# EAGLE design XMICRO-BREAKOUT-CARD (EAGLE 6.3)
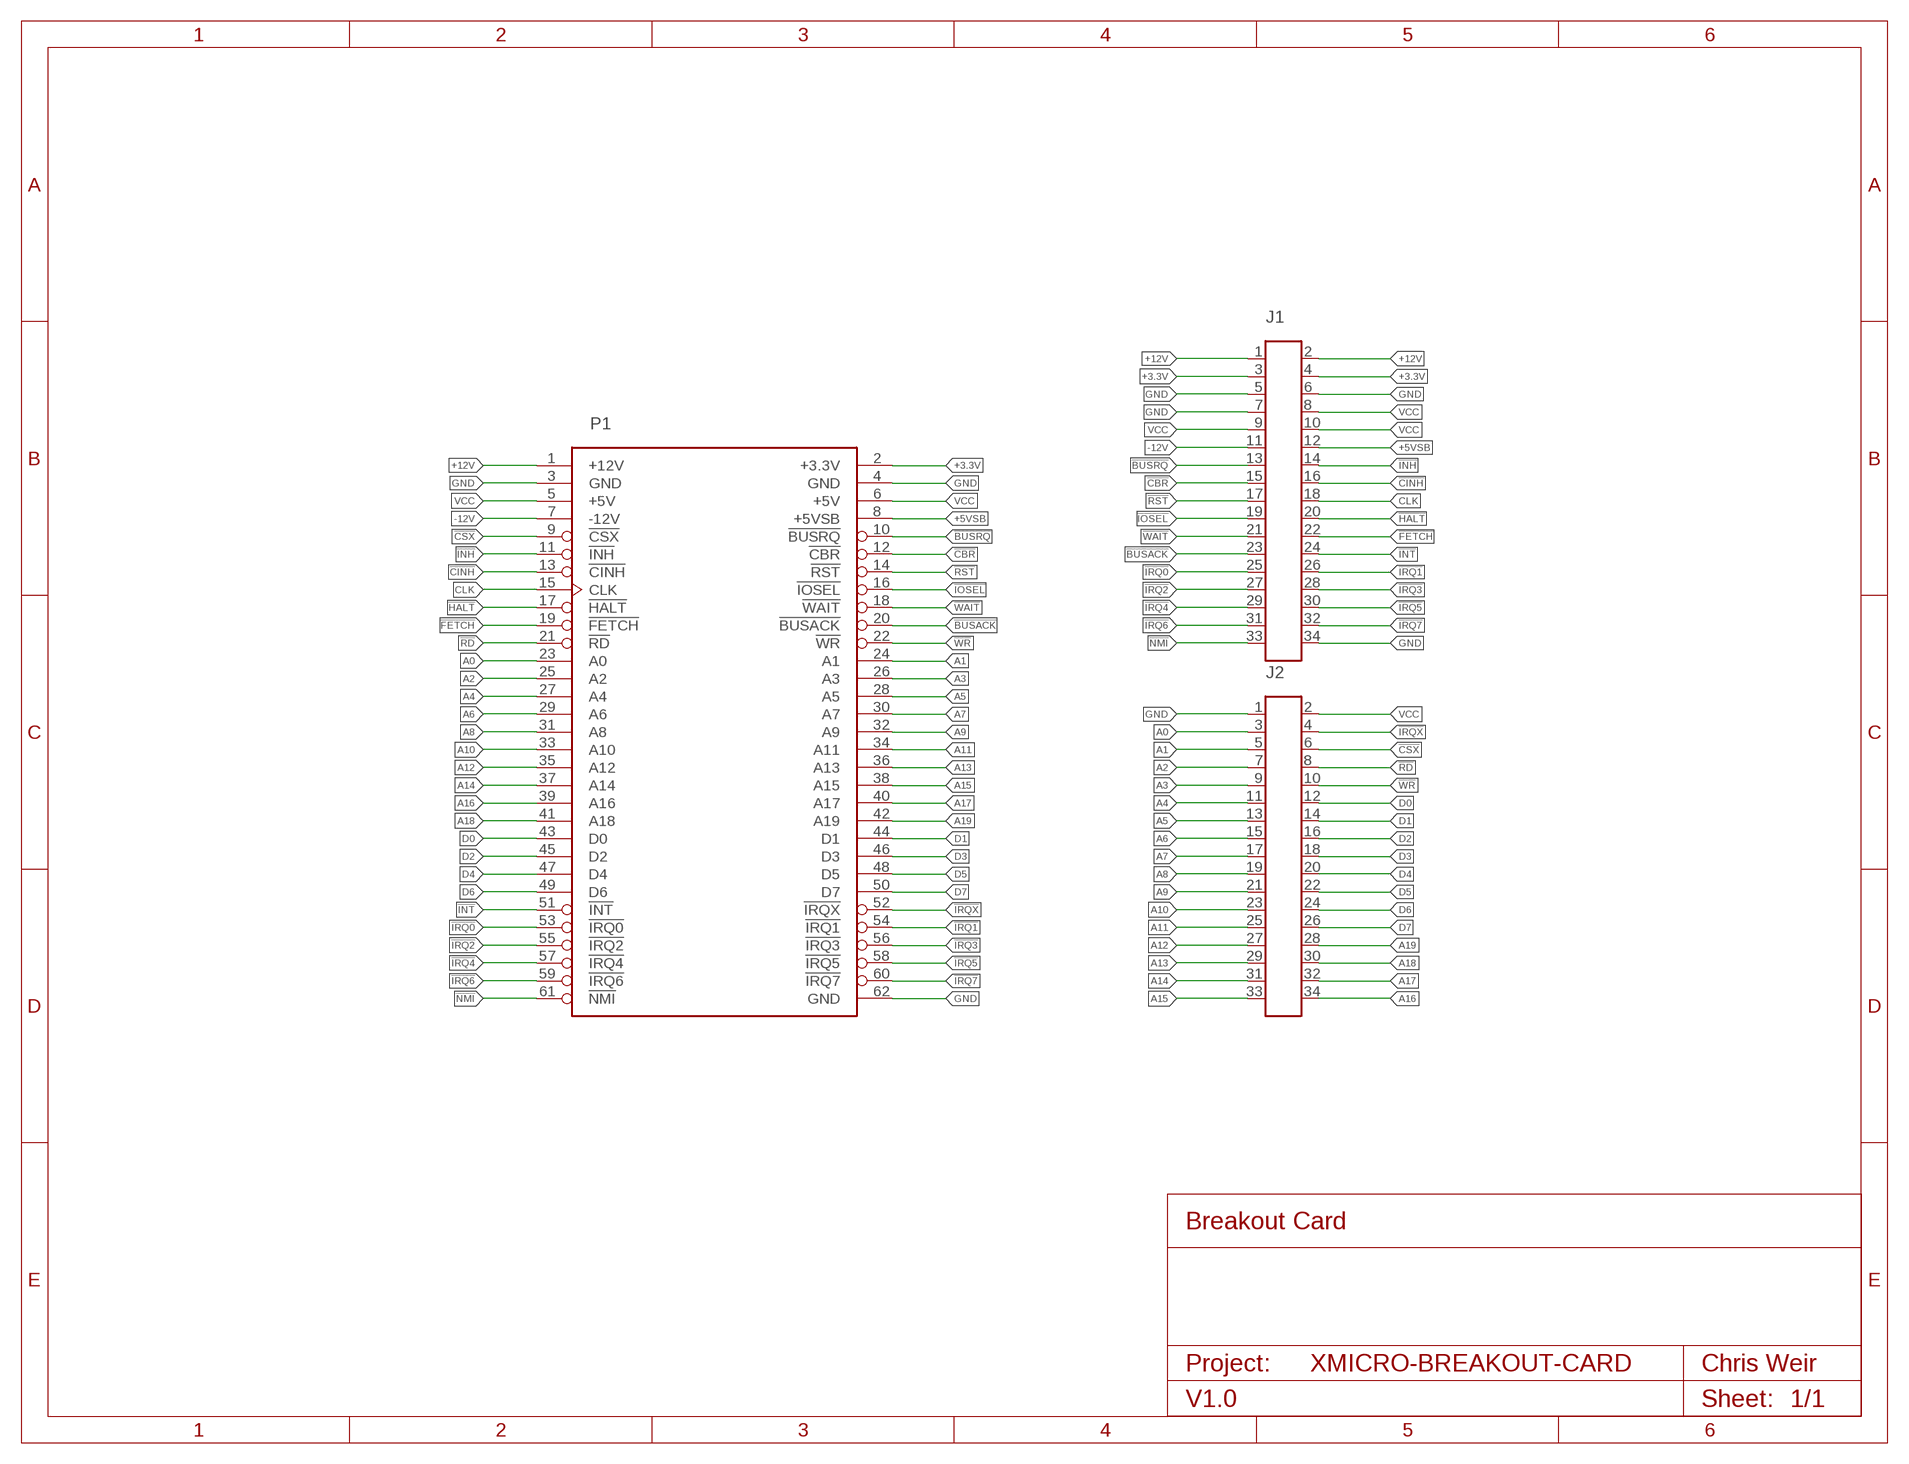
[diagram p0: schematic, sheet 1]

## Parts
J1  HDR-17X2  [HDR-17X2S]
J2  HDR-17X2  [HDR-17X2S]
P1  XMICRO-BUS-PHYSICAL-EDGE62M  [EDGE62M]

## Nets
!BUSACK: J1.23 P1.20(!BUSACK)
!BUSRQ: J1.13 P1.10(!BUSRQ)
!CBR: J1.15 P1.12(!CBR)
!CINH: J1.16 P1.13(!CINH)
!CSX: J2.6 P1.9(!CSX)
!FETCH: J1.22 P1.19(!FETCH)
!HALT: J1.20 P1.17(!HALT)
!INH: J1.14 P1.11(!INH)
!INT: J1.24 P1.51(!INT)
!IOSEL: J1.19 P1.16(!IOSEL)
!IRQ0: J1.25 P1.53(!IRQ0)
!IRQ1: J1.26 P1.54(!IRQ1)
!IRQ2: J1.27 P1.55(!IRQ2)
!IRQ3: J1.28 P1.56(!IRQ3)
!IRQ4: J1.29 P1.57(!IRQ4)
!IRQ5: J1.30 P1.58(!IRQ5)
!IRQ6: J1.31 P1.59(!IRQ6)
!IRQ7: J1.32 P1.60(!IRQ7)
!IRQX: J2.4 P1.52(!IRQX)
!NMI: J1.33 P1.61(!NMI)
!RD: J2.8 P1.21(!RD)
!RST: J1.17 P1.14(!RST)
!WAIT: J1.21 P1.18(!WAIT)
!WR: J2.10 P1.22(!WR)
+3.3V: J1.3 J1.4 P1.2(+3.3V)
+5VSB: J1.12 P1.8(+5VSB)
+12V: J1.1 J1.2 P1.1(+12V)
-12V: J1.11 P1.7(-12V)
A0: J2.3 P1.23(A0)
A1: J2.5 P1.24(A1)
A2: J2.7 P1.25(A2)
A3: J2.9 P1.26(A3)
A4: J2.11 P1.27(A4)
A5: J2.13 P1.28(A5)
A6: J2.15 P1.29(A6)
A7: J2.17 P1.30(A7)
A8: J2.19 P1.31(A8)
A9: J2.21 P1.32(A9)
A10: J2.23 P1.33(A10)
A11: J2.25 P1.34(A11)
A12: J2.27 P1.35(A12)
A13: J2.29 P1.36(A13)
A14: J2.31 P1.37(A14)
A15: J2.33 P1.38(A15)
A16: J2.34 P1.39(A16)
A17: J2.32 P1.40(A17)
A18: J2.30 P1.41(A18)
A19: J2.28 P1.42(A19)
CLK: J1.18 P1.15(CLK)
D0: J2.12 P1.43(D0)
D1: J2.14 P1.44(D1)
D2: J2.16 P1.45(D2)
D3: J2.18 P1.46(D3)
D4: J2.20 P1.47(D4)
D5: J2.22 P1.48(D5)
D6: J2.24 P1.49(D6)
D7: J2.26 P1.50(D7)
GND: J1.5 J1.6 J1.7 J1.34 J2.1 P1.3(GND) P1.4(GND) P1.62(GND)
VCC: J1.8 J1.9 J1.10 J2.2 P1.5(+5V) P1.6(+5V)

## Notes on the sheet
- Breakout Card
- Project: | Chris Weir
- V1.0 | Sheet:

## Library data of the parts
J1 J2 = Custom:HDR-17X2
P1 = Custom:XMICRO-BUS-PHYSICAL

## Net classes
1 GND: width 0.254 mm, clearance 0.381 mm

## Board
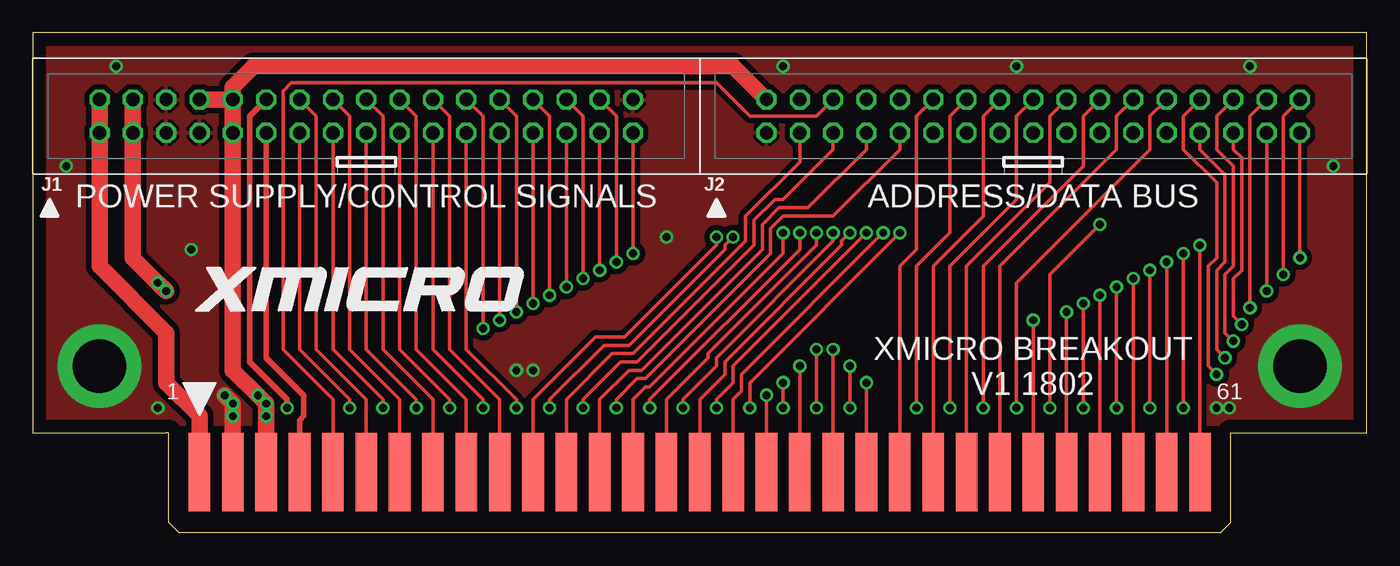
[diagram p1: board, top side]
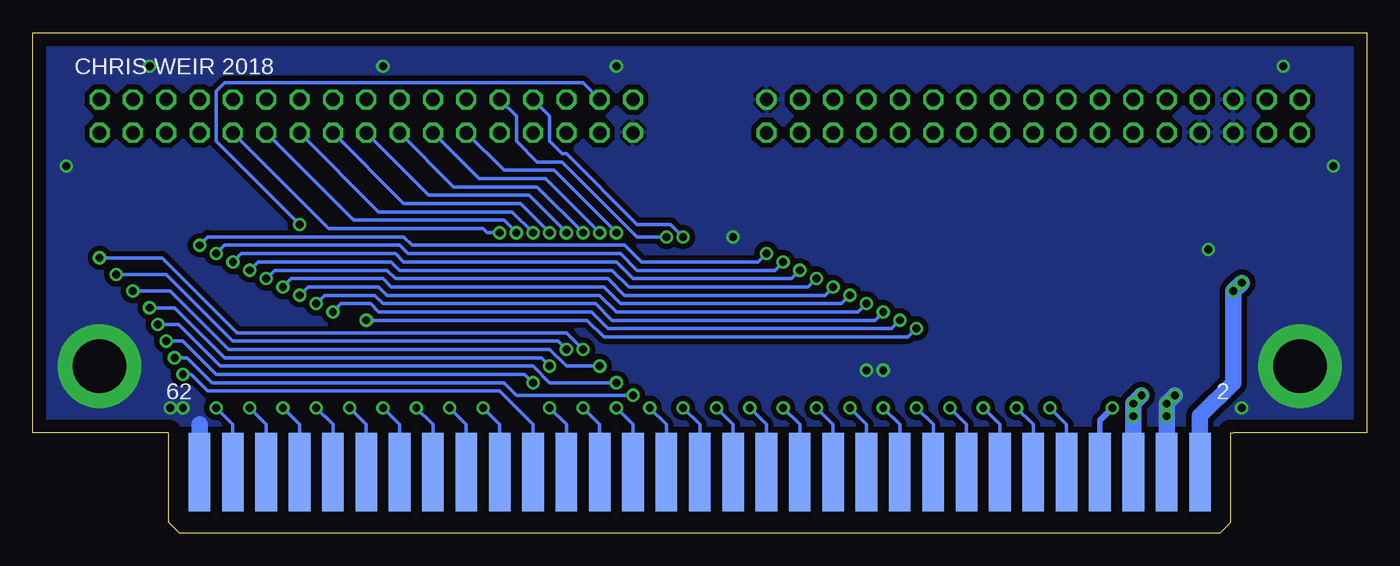
[diagram p2: board, bottom side, seen from below]

Size 101.6 x 38.1 mm. Coordinates in mm from the lower left corner, seen from the top.
Outline: 10.16,7.62 0,7.62 0,38.1 101.6,38.1 101.6,7.62 91.44,7.62
Copper layers (1*16): Top 0.035mm / dielectric 1.5mm / Bottom 0.035mm
Design rules "default *": minimum track width 10mil, minimum drill 0.3mm, track to track 10mil, track to pad 10mil, pad to pad 10mil, via to via 10mil, smd to smd 10mil, copper to edge 40mil, drill to drill 10mil, minimum pad ring 10mil, minimum via ring 8mil, stop-mask expansion 4mil, vias tented up to drill 40mil, thermal gap 10mil

### Footprints (pad centres in the part's own frame; a part is rotated, then mirrored left to right if it is on the bottom)
HDR-17X2S = drill 1.016 octagon: 1 -20.32,-1.27; 2 -20.32,1.27; 3 -17.78,-1.27; 4 -17.78,1.27; 5 -15.24,-1.27; 6 -15.24,1.27; 7 -12.7,-1.27; 8 -12.7,1.27; 9 -10.16,-1.27; 10 -10.16,1.27; 11 -7.62,-1.27; 12 -7.62,1.27; 13 -5.08,-1.27; 14 -5.08,1.27; 15 -2.54,-1.27; 16 -2.54,1.27; 17 0,-1.27; 18 0,1.27; 19 2.54,-1.27; 20 2.54,1.27; 21 5.08,-1.27; 22 5.08,1.27; 23 7.62,-1.27; 24 7.62,1.27; 25 10.16,-1.27; 26 10.16,1.27; 27 12.7,-1.27; 28 12.7,1.27; 29 15.24,-1.27; 30 15.24,1.27; 31 17.78,-1.27; 32 17.78,1.27; 33 20.32,-1.27; 34 20.32,1.27
EDGE62M = smd 1.651 x 5.969: 1 -38.1,-3.01; 3 -35.56,-3.01; 5 -33.02,-3.01; 7 -30.48,-3.01; 9 -27.94,-3.01; 11 -25.4,-3.01; 13 -22.86,-3.01; 15 -20.32,-3.01; 17 -17.78,-3.01; 19 -15.24,-3.01; 21 -12.7,-3.01; 23 -10.16,-3.01; 25 -7.62,-3.01; 27 -5.08,-3.01; 29 -2.54,-3.01; 31 0,-3.01; 33 2.54,-3.01; 35 5.08,-3.01; 37 7.62,-3.01; 39 10.16,-3.01; 41 12.7,-3.01; 43 15.24,-3.01; 45 17.78,-3.01; 47 20.32,-3.01; 49 22.86,-3.01; 51 25.4,-3.01; 53 27.94,-3.01; 55 30.48,-3.01; 57 33.02,-3.01; 59 35.56,-3.01; 61 38.1,-3.01 | smd 1.651 x 5.969 bottom: 2 -38.1,-3.01; 4 -35.56,-3.01; 6 -33.02,-3.01; 8 -30.48,-3.01; 10 -27.94,-3.01; 12 -25.4,-3.01; 14 -22.86,-3.01; 16 -20.32,-3.01; 18 -17.78,-3.01; 20 -15.24,-3.01; 22 -12.7,-3.01; 24 -10.16,-3.01; 26 -7.62,-3.01; 28 -5.08,-3.01; 30 -2.54,-3.01; 32 0,-3.01; 34 2.54,-3.01; 36 5.08,-3.01; 38 7.62,-3.01; 40 10.16,-3.01; 42 12.7,-3.01; 44 15.24,-3.01; 46 17.78,-3.01; 48 20.32,-3.01; 50 22.86,-3.01; 52 25.4,-3.01; 54 27.94,-3.01; 56 30.48,-3.01; 58 33.02,-3.01; 60 35.56,-3.01; 62 38.1,-3.01

### Placement (x,y rotation side)
J1  25.4,31.75 0 top
J2  76.2,31.75 0 top
P1  50.8,7.62 0 top

### Tracks (layer width: path | path; a pad name or v marks a point on that pad's centre or on a via)
!BUSACK  (via drill 0.6)
  Top 0.254: v36.83,9.53 36.83,10.16 33.02,13.97 J1.23
  Bottom 0.254: P1.20 35.56,8.26 v36.83,9.53
!BUSRQ  (via drill 0.6)
  Top 0.254: v24.13,9.53 24.13,10.16 20.32,13.97 J1.13
  Bottom 0.254: P1.10 22.86,8.26 v24.13,9.53
!CBR  (via drill 0.6)
  Top 0.254: v26.67,9.53 26.67,10.16 22.86,13.97 J1.15
  Bottom 0.254: P1.12 25.4,8.26 v26.67,9.53
!CINH
  Top 0.254: P1.13 27.94,10.16 24.13,13.97 24.13,31.75 J1.16
!CSX
  Top 0.254: P1.9 22.86,10.16 19.05,13.97 19.05,33.66 19.68,34.29 52.07,34.29 54.61,31.75 59.69,31.75 J2.6
!FETCH
  Top 0.254: P1.19 35.56,10.16 31.75,13.97 31.75,31.75 J1.22
!HALT
  Top 0.254: P1.17 33.02,10.16 29.21,13.97 29.21,31.75 J1.20
!INH
  Top 0.254: P1.11 25.4,10.16 21.59,13.97 21.59,31.75 J1.14
!INT  (via drill 0.6)
  Top 0.254: J1.24 34.29,31.75 v34.29,15.56 | v76.2,16.19 P1.51
  Bottom 0.254: v76.2,16.19 59.37,16.19 58.1,14.92 34.92,14.92 v34.29,15.56
!IOSEL  (via drill 0.6)
  Top 0.254: v31.75,9.53 31.75,10.16 27.94,13.97 J1.19
  Bottom 0.254: P1.16 30.48,8.26 v31.75,9.53
!IRQ0  (via drill 0.6)
  Top 0.254: P1.53 v78.74,16.83 | v35.56,16.19 J1.25
  Bottom 0.254: v78.74,16.83 78.11,17.46 75.88,17.46 75.25,16.83 59.05,16.83 57.78,15.56 36.2,15.56 v35.56,16.19
!IRQ1  (via drill 0.6)
  Top 0.254: v80.01,9.53 v80.01,17.46 | J1.26 36.83,31.75 v36.83,16.83
  Bottom 0.254: P1.54 78.74,8.26 v80.01,9.53 | v80.01,17.46 79.38,18.1 75.56,18.1 74.93,17.46 58.74,17.46 57.47,16.19 37.47,16.19 v36.83,16.83
!IRQ2  (via drill 0.6)
  Top 0.254: P1.55 v81.28,18.1 | v38.1,17.46 J1.27
  Bottom 0.254: v81.28,18.1 80.64,18.73 75.25,18.73 74.61,18.1 58.42,18.1 57.15,16.83 38.73,16.83 v38.1,17.46
!IRQ3  (via drill 0.6)
  Top 0.254: v82.55,9.53 v82.55,18.73 | J1.28 39.37,31.75 v39.37,18.1
  Bottom 0.254: P1.56 81.28,8.26 v82.55,9.53 | v82.55,18.73 81.92,19.37 74.93,19.37 74.3,18.73 58.1,18.73 56.83,17.46 40.01,17.46 v39.37,18.1
!IRQ4  (via drill 0.6)
  Top 0.254: P1.57 v83.82,19.37 | J1.29 v40.64,18.73
  Bottom 0.254: v83.82,19.37 83.19,20 74.61,20 73.98,19.37 57.78,19.37 56.52,18.1 41.27,18.1 v40.64,18.73
!IRQ5  (via drill 0.6)
  Top 0.254: v85.09,9.53 v85.09,20 | J1.30 41.91,31.75 v41.91,19.37
  Bottom 0.254: P1.58 83.82,8.26 v85.09,9.53 | v85.09,20 84.45,20.64 74.3,20.64 73.66,20 57.47,20 56.2,18.73 42.55,18.73 v41.91,19.37
!IRQ6  (via drill 0.6)
  Top 0.254: P1.59 v86.36,20.64 | J1.31 v43.18,20
  Bottom 0.254: v86.36,20.64 85.72,21.27 73.98,21.27 73.34,20.64 57.15,20.64 55.88,19.37 43.81,19.37 v43.18,20
!IRQ7  (via drill 0.6)
  Top 0.254: v87.63,9.53 v87.63,21.27 | J1.32 44.45,31.75 v44.45,20.64
  Bottom 0.254: P1.60 86.36,8.26 v87.63,9.53 | v87.63,21.27 87,21.91 73.66,21.91 73.03,21.27 56.83,21.27 55.56,20 45.09,20 v44.45,20.64
!IRQX  (via drill 0.6)
  Top 0.254: v81.28,23.5 77.47,19.68 v77.47,9.53
  Bottom 0.254: v81.28,23.5 87.63,29.84 87.63,33.66 87,34.29 59.69,34.29 J2.4 | P1.52 76.2,8.26 v77.47,9.53
!NMI  (via drill 0.6)
  Top 0.254: P1.61 v88.9,21.91 | J1.33 v45.72,21.27
  Bottom 0.254: v88.9,21.91 88.27,22.54 73.34,22.54 72.71,21.91 56.52,21.91 55.24,20.64 46.35,20.64 v45.72,21.27
!RD  (via drill 0.6)
  Top 0.254: P1.21 38.1,10.16 42.86,14.92 45.09,14.92 52.07,21.91 v52.07,22.54
  Bottom 0.254: v52.07,22.54 53.02,23.5 55.56,23.5 60.96,28.89 61.28,28.89 62.23,29.84 62.23,31.75 J2.8
!RST  (via drill 0.6)
  Top 0.254: v29.21,9.53 29.21,10.16 25.4,13.97 J1.17
  Bottom 0.254: P1.14 27.94,8.26 v29.21,9.53
!WAIT  (via drill 0.6)
  Top 0.254: v34.29,9.53 34.29,10.16 30.48,13.97 J1.21
  Bottom 0.254: P1.18 33.02,8.26 v34.29,9.53
!WR  (via drill 0.6)
  Top 0.254: v39.37,9.53 39.37,10.16 43.5,14.29 45.4,14.29 52.7,21.59 52.7,21.91 v53.34,22.54
  Bottom 0.254: P1.22 38.1,8.26 v39.37,9.53 | J2.10 64.77,31.75 64.77,29.84 63.18,28.26 61.28,28.26 55.56,22.54 v53.34,22.54
+3.3V  (via drill 0.6)
  Top 1.27: J1.4 J1.3 7.62,20.95 v9.53,19.05 v10.16,18.41
  Bottom 1.27: P1.2 12.7,8.89 10.16,11.43 v10.16,18.41 v9.53,19.05
+5VSB  (via drill 0.6)
  Top 0.406: v19.37,9.53 19.37,10.16 16.51,13.02 16.51,31.75 J1.12
  Bottom 0.406: P1.8 20.32,8.57 v19.37,9.53
+12V
  Top 1.27: P1.1 12.7,8.89 10.16,11.43 10.16,15.24 5.08,20.32 J1.1 J1.2
-12V
  Top 0.406: P1.7 20.32,8.57 20.64,8.89 20.64,10.48 17.78,13.34 J1.11
A0
  Top 0.254: P1.23 40.64,10.16 44.13,13.65 45.72,13.65 54.29,22.23 54.29,24.13 58.42,28.26 J2.3
A1  (via drill 0.6)
  Top 0.254: v41.91,9.53 41.91,10.16 44.77,13.02 46.04,13.02 54.93,21.91 54.93,23.81 56.52,25.4 57.15,25.4 60.96,29.21 J2.5
  Bottom 0.254: P1.24 40.64,8.26 v41.91,9.53
A2
  Top 0.254: P1.25 43.18,10.16 45.4,12.38 46.35,12.38 55.56,21.59 55.56,23.5 56.83,24.77 59.05,24.77 63.5,29.21 J2.7
A3  (via drill 0.6)
  Top 0.254: v44.45,9.53 44.45,10.16 46.04,11.75 46.67,11.75 56.2,21.27 56.2,23.18 57.15,24.13 60.96,24.13 66.04,29.21 J2.9
  Bottom 0.254: P1.26 43.18,8.26 v44.45,9.53
A4  (via drill 0.6)
  Top 0.254: P1.27 45.72,10.16 46.67,11.11 46.99,11.11 57.15,21.27 v57.15,22.86
  Bottom 0.254: J2.11 65.72,27.62 61.91,27.62 v57.15,22.86
A5  (via drill 0.6)
  Top 0.254: v46.99,9.53 46.99,10.16 58.42,21.59 v58.42,22.86
  Bottom 0.254: J2.13 67.63,26.99 62.55,26.99 v58.42,22.86 | P1.28 45.72,8.26 v46.99,9.53
A6  (via drill 0.6)
  Top 0.254: P1.29 48.26,10.16 51.44,13.34 51.44,13.65 59.69,21.91 v59.69,22.86
  Bottom 0.254: J2.15 69.53,26.35 63.18,26.35 v59.69,22.86
A7  (via drill 0.6)
  Top 0.254: v49.53,9.53 49.53,10.16 52.07,12.7 52.07,13.34 60.96,22.23 v60.96,22.86
  Bottom 0.254: J2.17 71.44,25.72 63.82,25.72 v60.96,22.86 | P1.30 48.26,8.26 v49.53,9.53
A8  (via drill 0.6)
  Top 0.254: P1.31 50.8,10.16 52.7,12.06 52.7,13.02 61.59,21.91 61.59,22.23 v62.23,22.86
  Bottom 0.254: J2.19 73.34,25.08 64.45,25.08 v62.23,22.86
A9  (via drill 0.6)
  Top 0.254: v52.07,9.53 52.07,10.16 53.34,11.43 53.34,12.7 v63.5,22.86
  Bottom 0.254: J2.21 75.25,24.45 65.09,24.45 v63.5,22.86 | P1.32 50.8,8.26 v52.07,9.53
A10  (via drill 0.6)
  Top 0.254: P1.33 53.34,10.16 53.98,10.79 53.98,12.06 v64.77,22.86
  Bottom 0.254: J2.23 77.15,23.81 65.72,23.81 v64.77,22.86
A11  (via drill 0.6)
  Top 0.254: v54.61,9.53 54.61,11.43 v66.04,22.86
  Bottom 0.254: J2.25 79.06,23.18 67.31,23.18 66.99,22.86 v66.04,22.86 | P1.34 53.34,8.26 v54.61,9.53
A12  (via drill 0.6)
  Top 0.254: J2.27 88.9,29.21 90.81,27.3 90.81,20.64 90.17,20 90.17,13.97 v90.81,13.34 | v55.88,10.48 P1.35
  Bottom 0.254: v90.81,13.34 89.85,13.34 87.95,11.43 65.72,11.43 64.77,10.48 v55.88,10.48
A13  (via drill 0.6)
  Top 0.254: J2.29 91.44,29.21 92.08,28.57 92.08,20 91.44,19.37 91.44,16.51 v92.08,15.88 | v57.15,11.43 v57.15,9.53
  Bottom 0.254: v92.08,15.88 90.49,15.88 87.31,12.7 63.5,12.7 62.23,11.43 v57.15,11.43 | v57.15,9.53 55.88,8.26 P1.36
A14  (via drill 0.6)
  Top 0.254: J2.31 v93.98,18.41 | v58.42,12.7 P1.37
  Bottom 0.254: v93.98,18.41 91.12,18.41 86.68,13.97 62.23,13.97 60.96,12.7 v58.42,12.7
A15  (via drill 0.6)
  Top 0.254: J2.33 v96.52,20.95 | v59.69,13.97 v59.69,9.53
  Bottom 0.254: v96.52,20.95 91.76,20.95 86.04,15.24 60.96,15.24 v59.69,13.97 | v59.69,9.53 58.42,8.26 P1.38
A16  (via drill 0.6)
  Top 0.254: J2.34 95.25,31.75 v95.25,19.68 | v60.96,13.97 P1.39
  Bottom 0.254: v95.25,19.68 91.44,19.68 86.36,14.61 61.59,14.61 v60.96,13.97
A17  (via drill 0.6)
  Top 0.254: J2.32 92.71,31.75 v92.71,17.14 | v62.23,12.7 v62.23,9.53
  Bottom 0.254: v92.71,17.14 90.81,17.14 87,13.34 62.87,13.34 v62.23,12.7 | v62.23,9.53 60.96,8.26 P1.40
A18  (via drill 0.6)
  Top 0.254: J2.30 90.17,31.75 90.17,29.21 91.44,27.94 91.44,20.32 90.81,19.68 90.81,15.24 v91.44,14.61 | v63.5,11.43 P1.41
  Bottom 0.254: v91.44,14.61 90.17,14.61 87.63,12.06 64.14,12.06 v63.5,11.43
A19  (via drill 0.6)
  Top 0.254: v90.17,12.06 89.53,12.7 89.53,20.32 90.17,20.95 90.17,26.67 87.63,29.21 87.63,31.75 J2.28
  Bottom 0.254: P1.42 63.5,8.26 66.04,10.79 88.27,10.79 89.53,12.06 v90.17,12.06
CLK
  Top 0.254: P1.15 30.48,10.16 26.67,13.97 26.67,31.75 J1.18
D0
  Top 0.254: P1.43 66.04,20.32 67.31,21.59 67.31,31.75 J2.12
D1  (via drill 0.6)
  Top 0.254: v67.31,9.53 67.31,20.32 69.85,22.86 69.85,31.75 J2.14
  Bottom 0.254: P1.44 66.04,8.26 v67.31,9.53
D2
  Top 0.254: J2.16 72.39,31.75 72.39,24.13 68.58,20.32 P1.45
D3  (via drill 0.6)
  Top 0.254: v69.85,9.53 69.85,20.32 74.93,25.4 74.93,31.75 J2.18
  Bottom 0.254: P1.46 68.58,8.26 v69.85,9.53
D4
  Top 0.254: P1.47 71.12,20.32 77.47,26.67 77.47,31.75 J2.20
D5  (via drill 0.6)
  Top 0.254: J2.22 80.01,31.75 80.01,27.94 72.39,20.32 v72.39,9.53
  Bottom 0.254: v72.39,9.53 71.12,8.26 P1.48
D6
  Top 0.254: P1.49 73.66,20.32 82.55,29.21 82.55,31.75 J2.24
D7  (via drill 0.6)
  Top 0.254: J2.26 85.09,31.75 85.09,29.21 74.93,19.05 v74.93,9.53
  Bottom 0.254: v74.93,9.53 73.66,8.26 P1.50
GND  (via drill 0.6, 4.06 pad 6.35)
  Top 1.27: v14.61,10.48 v15.24,9.84 v15.24,8.89 P1.3
  Bottom 1.27: P1.3 v15.24,8.89 v15.24,9.84 v14.61,10.48 | P1.62 88.9,8.26
  other vias: 5.08,12.7 96.52,12.7 36.83,12.38 38.1,12.38 48.26,22.54 57.15,35.56 74.93,35.56 92.71,35.56 99.06,27.94 90.17,9.53 6.35,35.56 2.54,27.94 9.53,9.53 12.06,21.59 91.12,9.53
  pour Top (isolate 0.406): 0,38.1 101.6,38.1 101.6,7.62 91.44,7.62 91.44,8.26 10.16,8.26 10.16,7.62 0,7.62
  pour Bottom (isolate 0.406): 0,38.1 101.6,38.1 101.6,7.62 91.44,7.62 91.44,8.26 10.16,8.26 10.16,7.62 0,7.62
VCC  (via drill 0.6)
  Top 1.27: J2.2 53.34,35.56 16.83,35.56 15.24,33.97 J1.10 | J1.10 J1.9 15.24,12.38 v17.14,10.48 v17.78,9.84 v17.78,8.89 P1.5 | J1.10 J1.8
  Bottom 1.27: P1.5 v17.78,8.89 v17.78,9.84 v17.14,10.48

### Text on the board
bPlace: CHRIS WEIR 2018
tNames: POWER SUPPLY/CONTROL SIGNALS | ADDRESS/DATA BUS | XMICRO BREAKOUT / V1 1802